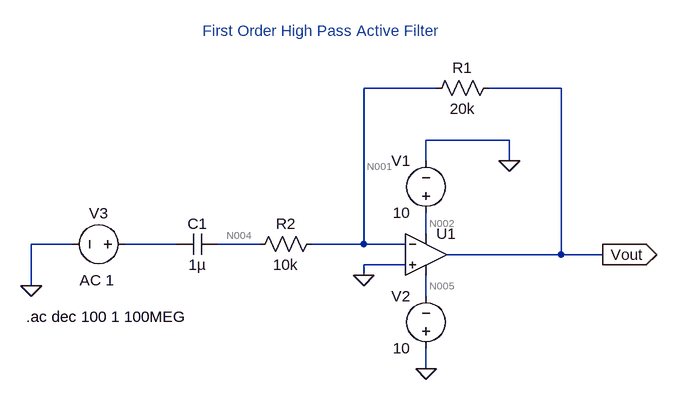
[diagram p0: schematic First Order High pass Active Filter.asc]
First Order High pass Active Filter.asc, the LTspice schematic file:
Version 4
SHEET 1 880 680
WIRE 256 -80 144 -80
WIRE 448 -80 336 -80
WIRE 368 0 240 0
WIRE 240 32 240 0
WIRE 368 32 368 0
WIRE 240 144 240 112
WIRE -304 160 -368 160
WIRE -144 160 -224 160
WIRE -16 160 -80 160
WIRE 144 160 144 -80
WIRE 144 160 64 160
WIRE 208 160 144 160
WIRE 448 176 448 -80
WIRE 448 176 272 176
WIRE 512 176 448 176
WIRE 208 192 144 192
WIRE 144 208 144 192
WIRE -368 224 -368 160
WIRE 240 240 240 208
WIRE 240 352 240 320
FLAG 368 32 0
FLAG 240 352 0
FLAG 144 208 0
FLAG -368 224 0
FLAG 512 176 Vout
IOPIN 512 176 Out
SYMBOL Opamps\\UniversalOpamp2 240 176 R0
SYMATTR InstName U1
SYMBOL voltage 240 128 R180
WINDOW 0 24 96 Left 2
WINDOW 3 24 16 Left 2
WINDOW 123 0 0 Left 0
WINDOW 39 0 0 Left 0
SYMATTR InstName V1
SYMATTR Value 10
SYMBOL voltage 240 336 R180
WINDOW 0 24 96 Left 2
WINDOW 3 24 16 Left 2
WINDOW 123 0 0 Left 0
WINDOW 39 0 0 Left 0
SYMATTR InstName V2
SYMATTR Value 10
SYMBOL res 352 -96 R90
WINDOW 0 0 56 VBottom 2
WINDOW 3 32 56 VTop 2
SYMATTR InstName R1
SYMATTR Value 20k
SYMBOL res 80 144 R90
WINDOW 0 0 56 VBottom 2
WINDOW 3 32 56 VTop 2
SYMATTR InstName R2
SYMATTR Value 10k
SYMBOL cap -80 144 R90
WINDOW 0 0 32 VBottom 2
WINDOW 3 32 32 VTop 2
SYMATTR InstName C1
SYMATTR Value 1µ
SYMBOL voltage -208 160 R90
WINDOW 0 -32 56 VBottom 2
WINDOW 3 32 56 VTop 2
WINDOW 123 40 59 VTop 2
WINDOW 39 0 0 Left 0
SYMATTR InstName V3
SYMATTR Value ""
SYMATTR Value2 AC 1
TEXT -104 -168 Left 2 ;First Order High Pass Active Filter
TEXT -376 272 Left 2 !.ac dec 100 1 100MEG

The netlist it stands for:
* First Order High pass Active Filter.asc
XU1 0 N001 N002 N005 Vout level.2 Avol=1Meg GBW=10Meg Slew=10Meg ilimit=25m rail=0 Vos=0 phimargin=45 en=0 enk=0 in=0 ink=0 Rin=500Meg  ; pins IN+ IN- V+ V- OUT
V1 N002 0 10
V2 0 N005 10
R1 Vout N001 20k
R2 N001 N004 10k
C1 N004 N003 1µ
V3 N003 0 AC 1
* First Order High Pass Active Filter
.ac dec 100 1 100MEG
.lib UniversalOpamps2.sub
.backanno
.end

* Results of the author's LTspice run, read from the files saved beside the schematic
* Operating Point, zero values left out:
*   V(n002) = 10 V
*   V(n005) = -10 V
*   I(V2) = -999.5 µA
*   I(V1) = -999.5 µA
*   Ix(u1:3) = 999.5 µA
*   Ix(u1:4) = -999.5 µA
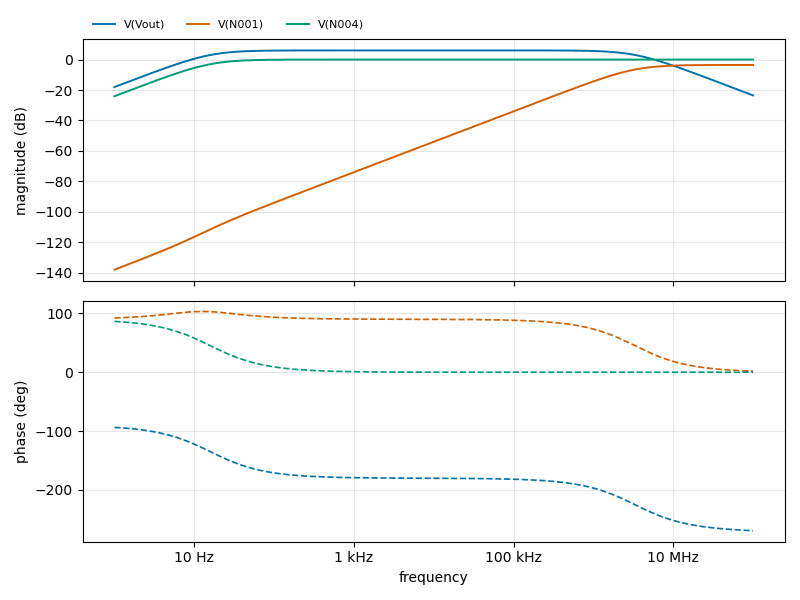
[diagram p1: AC Analysis of First Order High pass Active Filter.asc, plotted from the saved traces]
* AC Analysis, 1 run:
*   V(Vout): -18.03 dB at 1 Hz, -23.55 dB at 100 MHz, peak 6.02 dB at 7.244 kHz, 3 dB below the peak at 15.92 Hz and 3.326 MHz
*   V(N001): -137.96 dB at 1 Hz, -3.52 dB at 100 MHz, peak -3.52 dB at 100 MHz, 3 dB below the peak at 3.322 MHz
*   V(N004): -24.05 dB at 1 Hz, 0.00 dB at 100 MHz, peak 0.00 dB at 144.5 kHz, 3 dB below the peak at 15.92 Hz